# Altium project 3S UPS.PrjPcb
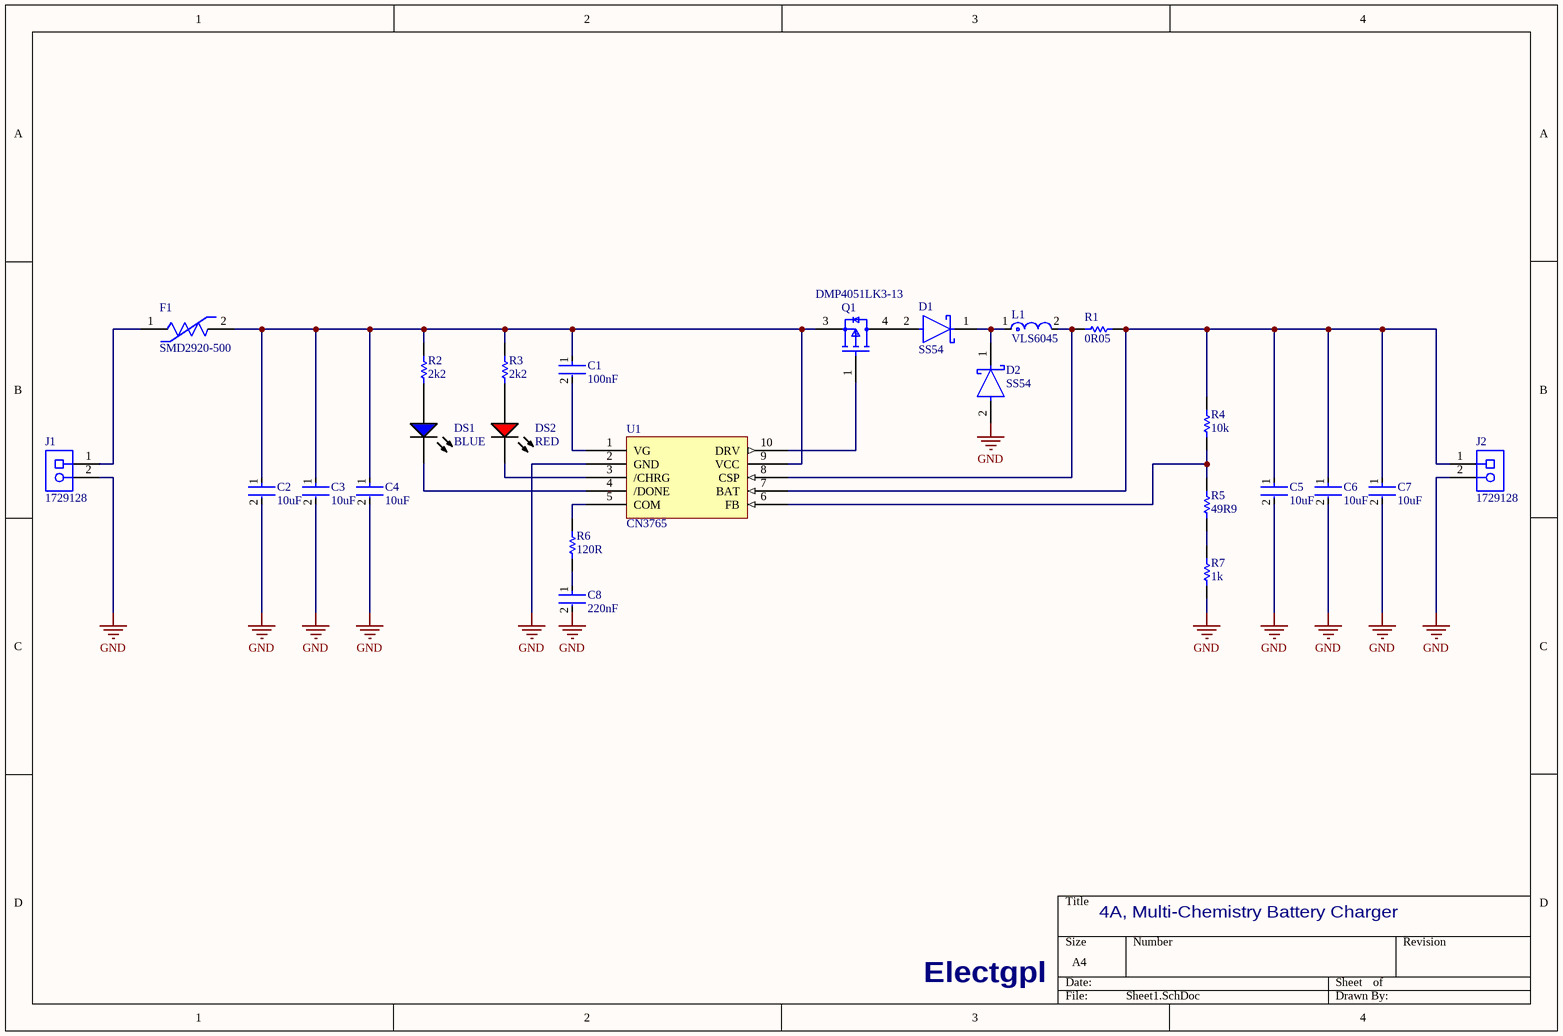
[diagram p0: Sheet1.SchDoc]
1 sheet, 25 parts. Net scope: global (net labels, ports and power ports of the same name join across sheets).
Board file: PCB1.PcbDoc

## Sheet Sheet1.SchDoc
size A4; SheetNumber: 1; SheetTotal: 1

### Parts
C1  100nF  [FP-C0603C-CF-MFG]
C2  10uF  [FP-GRM21B-0_1-IPC_C]
C3  10uF  [FP-GRM21B-0_1-IPC_C]
C4  10uF  [FP-GRM21B-0_1-IPC_C]
C5  10uF  [FP-GRM21B-0_1-IPC_C]
C6  10uF  [FP-GRM21B-0_1-IPC_C]
C7  10uF  [FP-GRM21B-0_1-IPC_C]
C8  220nF  [FP-C0603C-CF-MFG]
D1  SS54  [FP-SMB-MFG]
D2  SS54  [FP-SMB-MFG]
DS1  BLUE  [VISH-TLMX1100-2_V]
DS2  RED  [VISH-TLMS1000_V]
F1  SMD2920-500  [FP-2920L-MFG]
J1  1729128  [PHOE-1729128-2_V]
J2  1729128  [PHOE-1729128-2_V]
L1  VLS6045  [FP-VLS6045EX-100M-MFG]
Q1  DMP4051LK3-13  [FP-TO252-MFG]
R1  0R05  [RESC3216X89X51LL25T25]
R2  2k2  [RESC1609X55X30LL15T15]
R3  2k2  [RESC1609X55X30LL15T15]
R4  10k  [RESC1609X55X30LL15T15]
R5  49R9  [RESC1609X55X30LL15T15]
R6  120R  [RESC1609X55X30LL15T15]
R7  1k  [RESC1609X55X30LL15T15]
U1  CN3765  [SOP100P600X175-10N]

### Nets
GND: C2.2 C3.2 C4.2 C5.2 C6.2 C7.2 C8.2 D2.2(A) J1.2 J2.2 R7.1 U1.2(GND)
NetC1_1: C1.1 C2.1 C3.1 C4.1 F1.2 Q1.3(S) R2.2 R3.2 U1.9(VCC)
NetC1_2: C1.2 U1.1(VG)
NetC5_1: C5.1 C6.1 C7.1 J2.1 R1.2 R4.2 U1.7(BAT)
NetC8_1: C8.1 R6.1
NetD1_1: D1.1(K) D2.1(K) L1.1
NetD1_2: D1.2(A) Q1.4(D)
NetDS1_1: DS1.1(A) R2.1
NetDS1_2: DS1.2(K) U1.4(/DONE)
NetDS2_1: DS2.1(A) R3.1
NetDS2_2: DS2.2(K) U1.3(/CHRG)
NetF1_1: F1.1 J1.1
NetL1_2: L1.2 R1.1 U1.8(CSP)
NetQ1_1: Q1.1(G) U1.10(DRV)
NetR4_1: R4.1 R5.2 U1.6(FB)
NetR5_1: R5.1 R7.2
NetR6_2: R6.2 U1.5(COM)

### Notes on the sheet
- 4A, Multi-Chemistry Battery Charger
- Electgpl

### Library data of the parts
C1 C8 = CMP-2006-03146-2: CAP CER 0.22UF 25V 10% X7R 0603; Manufacturer: KEMET; Manufacturer Part Number: C0603C224K3RACTU; Temperature Coefficient: 30ppm/°C; Value: 0.22 μF; Material: Ceramic; Tolerance: 0.1; Automotive Grade: Grade 1; Device Class L2: Capacitors; Automotive: Yes; RoHS: TRUE; Digikey Description: CAP CER 0.22UF 25V 10% X7R 0603; Package: C0603C-CF; Height: 0.87mm; Temperature Characteristic: X7R; Mouser Description: Multilayer Ceramic Capacitors MLCC - SMD/SMT 25volts 0.22uF X7R 10%; Device Class L3: Ceramic Capacitors; Lead Free: Yes; Capacitance: 0.22 μF; Device Class L1: Passive Components; ComponentLink2Description: Datasheet; Temperature: -55°C to +125°C; Voltage Rating: 25 V; Temperature Range Low: -55°C; ComponentLink2URL: https://api.kemet.com/component-edge/download/datasheet/C0603C100J5GACAUTO.pdf; Octopart: https://octopart.com/c0603c224k3ractu-kemet-129141; Temperature Range High: +125°C; Category: Cap
C2-C7 = CMP-2007-03453-2: Chip Multilayer Ceramic Capacitors for General Purpose, 0805, 10uF, X5R, 15%, 10%, 16V; Radiation Hardening: No; Thickness: 0.053inch; Voltage Rating (DC): 16V; Lead Free: Lead Free; Package Quantity: 1; Width: 1.25mm; Case Code (Imperial): 0805; Depth: 1.25mm; Packaging: Tape and Reel; Dielectric: X5R; Max Operating Temperature: 85°C; Tolerance: 10%; Voltage Rating: 16V; Voltage: 16V; Capacitance: 10uF; Height: 1.25mm; Case Code (Metric): 2012; Material: Ceramic; Mount: Surface Mount; Case/Package: 0805; REACH SVHC: No SVHC; Length: 2mm; Min Operating Temperature: -55°C; Termination: SMD/SMT
D1 D2 = CMP-12187-000024-1: DIODE SCHOTTKY 150V 3A SMB; Manufacturer Part Number: STPS3150U; Manufacturer: STMicroelectronics; Standoff Height: 0.05mm; Max Junction Temp: +175°C; Peak Reverse Current: 0.4uA; Max Surge Forward Current: 80A; Max Repetitive Reverse Voltage: 150V; Device Class L3: Schottky Diodes; Temperature Range High: +175°C; Digikey Description: DIODE SCHOTTKY 150V 3A SMB; ComponentLink2Description: Datasheet; ComponentLink2URL: https://www.st.com/resource/en/datasheet/stps3150.pdf; Category: Diode; Package: SMB; Mouser Description: Schottky Diodes & Rectifiers 3.0 Amp 150 Volt; Octopart: https://octopart.com/stps3150u-stmicroelectronics-39552976; Temperature: to +175°C; Device Class L2: Diodes; Height: 2.65mm; RoHS: TRUE; Lead Free: Yes; Forward Current: 3A; Device Class L1: Discrete Semiconductors; Automotive: No
DS1 = CMP-1666-00028-1: Blue LED, 10 mA, 3.9 V, -40 to 100 degC, 2-Pin SMD (0603), RoHS, Tape and Reel; Tolerance: 10%; Voltage Rating: 100 V; Capacitance: 10 nF; Type (Capacitors): X7R; Case\Package: Radial; ComponentLink1Description: Manufacturer URL; REACH SVHC: No SVHC; Package Quantity: 500; PackageDescription: 2-Pin Surface Mount Device, Body 1.6 x 0.8 mm; Pins: 2; ComponentLink2URL: http://download.siliconexpert.com/pdfs/2016/8/7/12/43/26/667/vsh_/manual/379263299541529tlmb1100.pdf; RoHSCompliant: true; Lead Pitch: 2.54 mm; Height: 2.54 mm; DatasheetVersion: Rev. 2.7, 03/2016; Length: 5.33 mm; ComponentLink1URL: http://www.vishay.com/; Min Operating Temperature: -55 degC; PackageReference: 0603; Packaging: Bulk; ComponentLink2Description: Datasheet; Max Operating Temperature: 125 degC; Radiation Hardening: No; Width: 3.81 mm; Mount: Through Hole
DS2 = CMP-2000-07254-1: Low Current LED, 40 mW, 1.8 V, -40 to 100 degC, 2-Pin SMD (0603), RoHS, Tape and Reel; Manufacturer: Vishay; Lens Shape: Rectangular; Automotive Qualification Standard: AEC-Q100; Wavelength Typ: 636nm; SVHC: ToBeAdvised; Bulb Size: 1.6mmx0.8mm; Forward Voltage: 1.8V; Luminous Intensity: 4mcd; Forward Current If: 2mA; Viewing Angle: 80°; Datasheet Version: Rev. 1.7, 02/2011; Datasheet URL: https://datasheet.ciiva.com/5798/1698881-5798337.pdf; LED Mounting: SMD; Packaging: CutTape; Package Reference: TLMS1000; Manufacturer URL: http://www.vishay.com/; Mounting Technology: SurfaceMount; Product Range: -; LED Colour: Red; Package Description: 2-Pin Surface Mount Device, Body 1.6 x 0.8 mm; MSL: MSL2-1year
F1 = CMP-08606-000028-1: PTC RESET FUSE 60V 1.1A 2920; Manufacturer Part Number: 2920L110/60MR; Manufacturer: Littelfuse; Value: 0.12-0.41Ω; Trip Time: 0.5s; Current Rating: 20A; Trip Current: 2.2A; Category: Fuse; Temperature: -40°C to +85°C; ComponentLink2Description: Datasheet; Lead Free: Yes; Temperature Range Low: -40°C; ComponentLink2URL: https://m.littelfuse.com/~/media/electronics/datasheets/resettable_ptcs/littelfuse_ptc_2920l_datasheet.pdf.pdf; Height: 2mm; Temperature Range High: +85°C; Automotive: No; Digikey Description: PTC RESET FUSE 60V 1.1A 2920; Device Class L3: unset; RoHS: TRUE; Device Class L2: PTC Resettable Fuses; Voltage Rating: 60V; Octopart: https://octopart.com/2920l110%2F60mr-littelfuse-75250824; Device Class L1: Circuit Protection; Package: 2920L; Hold Current: 1.1A; Ambient Temperature Range High: +85°C; Resistance: 0.12-0.41Ω; Ambient Temperature Range Low: -40°C
J1 J2 = CMP-2000-05815-1: PCB Terminal Block, 13.5 A, 400 V, 2-Pin THD, RoHS, Bulk; Manufacturer: Phoenix Contact; Package Version: 03/2015; No. of Rows: 1; Pitch: 5.08mm; No. of Positions: 2; Voltage Rating: 400V; Current Rating: 13500mA; Manufacturer URL: http://www.phoenixcontact.com/; Datasheet URL: https://datasheet.ciiva.com/16046/1729128-16046181.pdf; RoHS: TRUE; Package URL: https://www.phoenixcontact.com/online/portal/pi/pxc/product_detail_page/!ut/p/b1/3VdJjqNKFDxLH8AFycySyWY2ozFsEPOMMQaDOX1XedGL_1Vdm5YXJleknhSKeBkvI6EA8ncAo3AYoDhBQGco6KN7VURTdemj9us_IEKEZo_YHiPAEWEFmDGOHMORkqKYCORBZxgL7ZoaZYcbFFUZ3fqxSY6GOuxydWUuHqz1ynmMFygu583Bob0Ewr6Sd_l-5m-kAueHiB0jpRwZwe58wwtkpxtMYd_LmGcDRU02dRNEyWt6Y2ti5pSyJ_reIkzIulrqApdnbT11V5jnCKbYNCvhEM1MCpPByat_X379-iThf08CI5GfOPqfBeS3BRoBOdD55AKVv0iLwCMq-2BrzXWSGRH7pUGD9uwXQjiph3xL0DKQwdGa0JImiIOmBNOestqgwTHSSs2oOep-78apyXQBvNi8ZLaFjvjWvcaUEBu0MC6Wbe-d6mB0FAebo2lUWinqYaZs5DAYzV0RP9yitUjnGJ0iI9xhZkT42OCQNUJJhkgWINNQLP2JFP6OpMg3JCVg70jqHT0lvKOnhHf0lPuOnnLf0VPuWx6_dxwUIvwk5WMkT0kLL1mh61l2yZVSzG3pYV_bqo-mj6uMKwKwdnnW8Jh5RTOJzMOA5c-eJDaZQw4mTMPH02PvS_ZAqNVjVTo2WyYLkwH_KU1mmmG5kjRhDqPXLwwVHvVOjCM60-fpXvTDfMGW1PVFVS1r4e4yVDk4ZdNbkUHvqPqQSeian4UD39fNKmachqdJ1NJbyk8rXT9mXTvPk3oE5meulKGgiruPJek-4I9hTT6G8ZLOyRSm2RRVbThERQad5OS28hdt4YW4vG0stgYYzsWsK4_7y6DZMjJSCqri1kyiZR5vD7pwIrNR7QwPHTcLTI5qT7eRlpHrdGiupYlqQDJ7zy_CND8fWWBoLRXxk1RVcXiBQwbTD4Xi7KL-FuO94t9xaqweXzH; PartNumber: 1729128; Package Description: 2-Pin Through Hole Device, Body 8.1 x 10.16 mm, Pitch 5.08 mm; Datasheet Version: 12/2013; Mounting Technology: ThroughHole; Orientation: Horizontal; Package Reference: 1729128-2; Packing: Bulk
L1 = CMP-08253-000184-1: FIXED IND 10UH 3.4A 61 MOHM SMD; Saturation Current: 3.9A; Shielding: Shielded; Test Frequency: 100kHz; Core Material: Ferrite; Inductance Tolerance: 20%; DC Resistance (DCR): 61mR; Current Rating: 3.4A; REACH SVHC: No SVHC; Min Operating Temperature: -40°C; RoHS Compliant: Yes; Length: 0.236inch; Lead Free: Lead Free; Packaging: Cut Tape; RMS Current (Irms): 3.4A; Width: 0.236inch; Case/Package: Nonstandard; Resistor Type: Wirewound; Inductance: 10uH; Height - Seated (Max): 0.177inch; Mount: Surface Mount; Max Operating Temperature: 105°C; Tolerance: 20%
Q1 = CMP-12801-000019-1: MOSFET P-CH 40V 7.2A DPAK; Manufacturer: Diodes Inc.; Turn On Delay Time: 2.3ns; Turn Off Delay Time: 25.1ns; Threshold Vgs Max: -3V; Max Forward Diode Voltage: -1.2V; Drain To Source Breakdown Voltage: -40V; Gate Charge At Vgs: 14nC @ -10V; Power Dissipation: 4.18W; Transconductance: 16.6S; Reverse Recovery Charge: 841nC; Input Capacitace At Vds: 674pF @ -20V; Gate To Source Voltage: 20V; Pulse Drain Current: -28.9A; Reverse Recovery Time: 138ns; Max Junction Temp: +150°C; Number Of P Channels: 1; Typ Forward Diode Voltage: -0.98V; Continuous Drain Current: -7.2A; Threshold Vgs Min: -1V; Standoff Height: 0mm; Drain To Source Resistance: 0.041Ω; Depletion Mode: False; Rthja Max: 29.9°C/W; ComponentLink2URL: https://www.diodes.com/assets/Datasheets/DMP4051LK3.pdf; Category: Trans; Device Class L1: Discrete Semiconductors; Footprint Url: https://www.diodes.com/assets/Package-Files/TO252-DPAK.pdf; Octopart: https://octopart.com/dmp4051lk3-13-diodes+inc.-17931392; Manufacturer Part Number: DMP4051LK3-13; RoHS: TRUE; Temperature: -55°C to +150°C; ComponentLink2Description: Datasheet; Height: 2.52mm; Device Class L2: Transistors; Digikey Description: MOSFET P-CH 40V 7.2A DPAK; Mouser Description: MOSFET ENHANCE MODE MOSFET 40V P-CHANNEL; Drain To Source Voltage: -40V; Package: TO252; Number Of Channels: 1; Device Class L3: MOSFETs; Temperature Range High: +150°C; Automotive: No; Lead Free: Yes; Temperature Range Low: -55°C
R1 = CMP-2003-04361-1: Manufacturer: Vishay Dale; Part Number: WSL1206R0500FEA
R2-R7 = CMP-1012-00623-3: Chip Resistor, 10 KOhm, +/- 1%, 0.1 W, -55 to 155 degC, 0603 (1608 Metric), RoHS, Tape and Reel; Manufacturer: Panasonic; Voltage Rating: 75V; Case\/Package: 0603; Power Rating: 100mW; Resistance: 10KOhm; Temperature Coefficient: 100ppm\/degreesC; Number of Pins: 2; Package Reference: 603; Depth: 0.8mm; Mount: SurfaceMount; Package Description: 2-Pin Surface Mount Device, Body 1.6 x 0.85 mm; Datasheet Version: 02/2017; Length: 1.6mm; Lead Free: LeadFree; Height: 0.45mm; Number of Terminations: 2; Max Power Dissipation: 100mW; Min Operating Temperature: -55degC; Datasheet URL: https://industrial.panasonic.com/cdbs/www-data/pdf/RDA0000/AOA0000C304.pdf; Termination: SMD/SMT; Case Code (Metric): 1608; Case Code (Imperial): 0603; Tolerance: 1%; Max Operating Temperature: 155degC; RoHSCompliant: true; Voltage Rating (DC): 75V; Radiation Hardening: No; Packaging: TapeandReel; Composition: ThickFilm; Mounting Technology: SurfaceMount; Manufacturer URL: http://www.panasonic.com/; Width: 0.031inch; REACH SVHC: NoSVHC; Contact Plating: Tin; Military Standard: Not; Package Quantity: 1
U1 = CMP-019-00051-1: SSOP-10 Battery Management ICs ROHS